# Altium schematic sheet PCMCIA_1.SchDoc
size A2
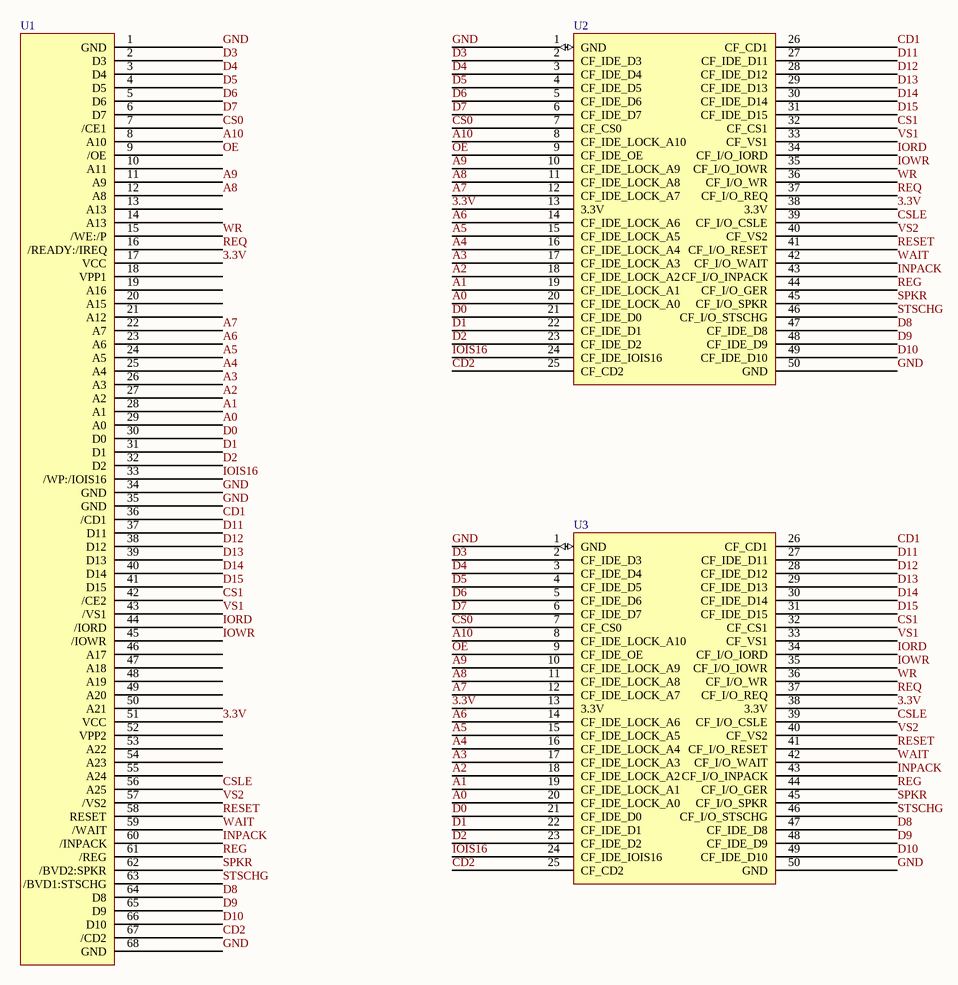
[diagram p0: PCMCIA_1.SchDoc]

## Parts
U1  (no value)  [PCMCIA_68pin_F]
U2  (no value)  [DIP40_600MIL]
U3  (no value)  [DIP40_600MIL]

## Nets
3.3V: U1.17(VCC) U1.51(VCC) U2.13(3.3V) U2.38(3.3V) U3.13(3.3V) U3.38(3.3V)
A0: U1.29(A0) U2.20(CF_IDE_LOCK_A0) U3.20(CF_IDE_LOCK_A0)
A1: U1.28(A1) U2.19(CF_IDE_LOCK_A1) U3.19(CF_IDE_LOCK_A1)
A2: U1.27(A2) U2.18(CF_IDE_LOCK_A2) U3.18(CF_IDE_LOCK_A2)
A3: U1.26(A3) U2.17(CF_IDE_LOCK_A3) U3.17(CF_IDE_LOCK_A3)
A4: U1.25(A4) U2.16(CF_IDE_LOCK_A4) U3.16(CF_IDE_LOCK_A4)
A5: U1.24(A5) U2.15(CF_IDE_LOCK_A5) U3.15(CF_IDE_LOCK_A5)
A6: U1.23(A6) U2.14(CF_IDE_LOCK_A6) U3.14(CF_IDE_LOCK_A6)
A7: U1.22(A7) U2.12(CF_IDE_LOCK_A7) U3.12(CF_IDE_LOCK_A7)
A8: U1.12(A8) U2.11(CF_IDE_LOCK_A8) U3.11(CF_IDE_LOCK_A8)
A9: U1.11(A9) U2.10(CF_IDE_LOCK_A9) U3.10(CF_IDE_LOCK_A9)
A10: U1.8(A10) U2.8(CF_IDE_LOCK_A10) U3.8(CF_IDE_LOCK_A10)
CD1: U1.36(/CD1) U2.26(CF_CD1) U3.26(CF_CD1)
CD2: U1.67(/CD2) U2.25(CF_CD2) U3.25(CF_CD2)
CS0: U1.7(/CE1) U2.7(CF_CS0) U3.7(CF_CS0)
CS1: U1.42(/CE2) U2.32(CF_CS1) U3.32(CF_CS1)
CSLE: U1.56(A25) U2.39(CF_I/O_CSLE) U3.39(CF_I/O_CSLE)
D0: U1.30(D0) U2.21(CF_IDE_D0) U3.21(CF_IDE_D0)
D1: U1.31(D1) U2.22(CF_IDE_D1) U3.22(CF_IDE_D1)
D2: U1.32(D2) U2.23(CF_IDE_D2) U3.23(CF_IDE_D2)
D3: U1.2(D3) U2.2(CF_IDE_D3) U3.2(CF_IDE_D3)
D4: U1.3(D4) U2.3(CF_IDE_D4) U3.3(CF_IDE_D4)
D5: U1.4(D5) U2.4(CF_IDE_D5) U3.4(CF_IDE_D5)
D6: U1.5(D6) U2.5(CF_IDE_D6) U3.5(CF_IDE_D6)
D7: U1.6(D7) U2.6(CF_IDE_D7) U3.6(CF_IDE_D7)
D8: U1.64(D8) U2.47(CF_IDE_D8) U3.47(CF_IDE_D8)
D9: U1.65(D9) U2.48(CF_IDE_D9) U3.48(CF_IDE_D9)
D10: U1.66(D10) U2.49(CF_IDE_D10) U3.49(CF_IDE_D10)
D11: U1.37(D11) U2.27(CF_IDE_D11) U3.27(CF_IDE_D11)
D12: U1.38(D12) U2.28(CF_IDE_D12) U3.28(CF_IDE_D12)
D13: U1.39(D13) U2.29(CF_IDE_D13) U3.29(CF_IDE_D13)
D14: U1.40(D14) U2.30(CF_IDE_D14) U3.30(CF_IDE_D14)
D15: U1.41(D15) U2.31(CF_IDE_D15) U3.31(CF_IDE_D15)
GND: U1.1(GND) U1.34(GND) U1.35(GND) U1.68(GND) U2.1(GND) U2.50(GND) U3.1(GND) U3.50(GND)
INPACK: U1.60(/INPACK) U2.43(CF_I/O_INPACK) U3.43(CF_I/O_INPACK)
IOIS16: U1.33(/WP:/IOIS16) U2.24(CF_IDE_IOIS16) U3.24(CF_IDE_IOIS16)
IORD: U1.44(/IORD) U2.34(CF_I/O_IORD) U3.34(CF_I/O_IORD)
IOWR: U1.45(/IOWR) U2.35(CF_I/O_IOWR) U3.35(CF_I/O_IOWR)
OE: U1.9(/OE) U2.9(CF_IDE_OE) U3.9(CF_IDE_OE)
REG: U1.61(/REG) U2.44(CF_I/O_GER) U3.44(CF_I/O_GER)
REQ: U1.16(/READY:/IREQ) U2.37(CF_I/O_REQ) U3.37(CF_I/O_REQ)
RESET: U1.58(RESET) U2.41(CF_I/O_RESET) U3.41(CF_I/O_RESET)
SPKR: U1.62(/BVD2:SPKR) U2.45(CF_I/O_SPKR) U3.45(CF_I/O_SPKR)
STSCHG: U1.63(/BVD1:STSCHG) U2.46(CF_I/O_STSCHG) U3.46(CF_I/O_STSCHG)
VS1: U1.43(/VS1) U2.33(CF_VS1) U3.33(CF_VS1)
VS2: U1.57(/VS2) U2.40(CF_VS2) U3.40(CF_VS2)
WAIT: U1.59(/WAIT) U2.42(CF_I/O_WAIT) U3.42(CF_I/O_WAIT)
WR: U1.15(/WE:/P) U2.36(CF_I/O_WR) U3.36(CF_I/O_WR)

Not connected (* = marked no-connect by the designer): U1 10(A11) 13(A13) 14(A13) 18(VPP1) 19(A16) 20(A15) 21(A12) 46(A17) 47(A18) 48(A19) 49(A20) 50(A21) 52(VPP2) 53(A22) 54(A23) 55(A24)

## Library data of the parts
U1 = Ultrasonic
U2 U3 = AT89S52_1